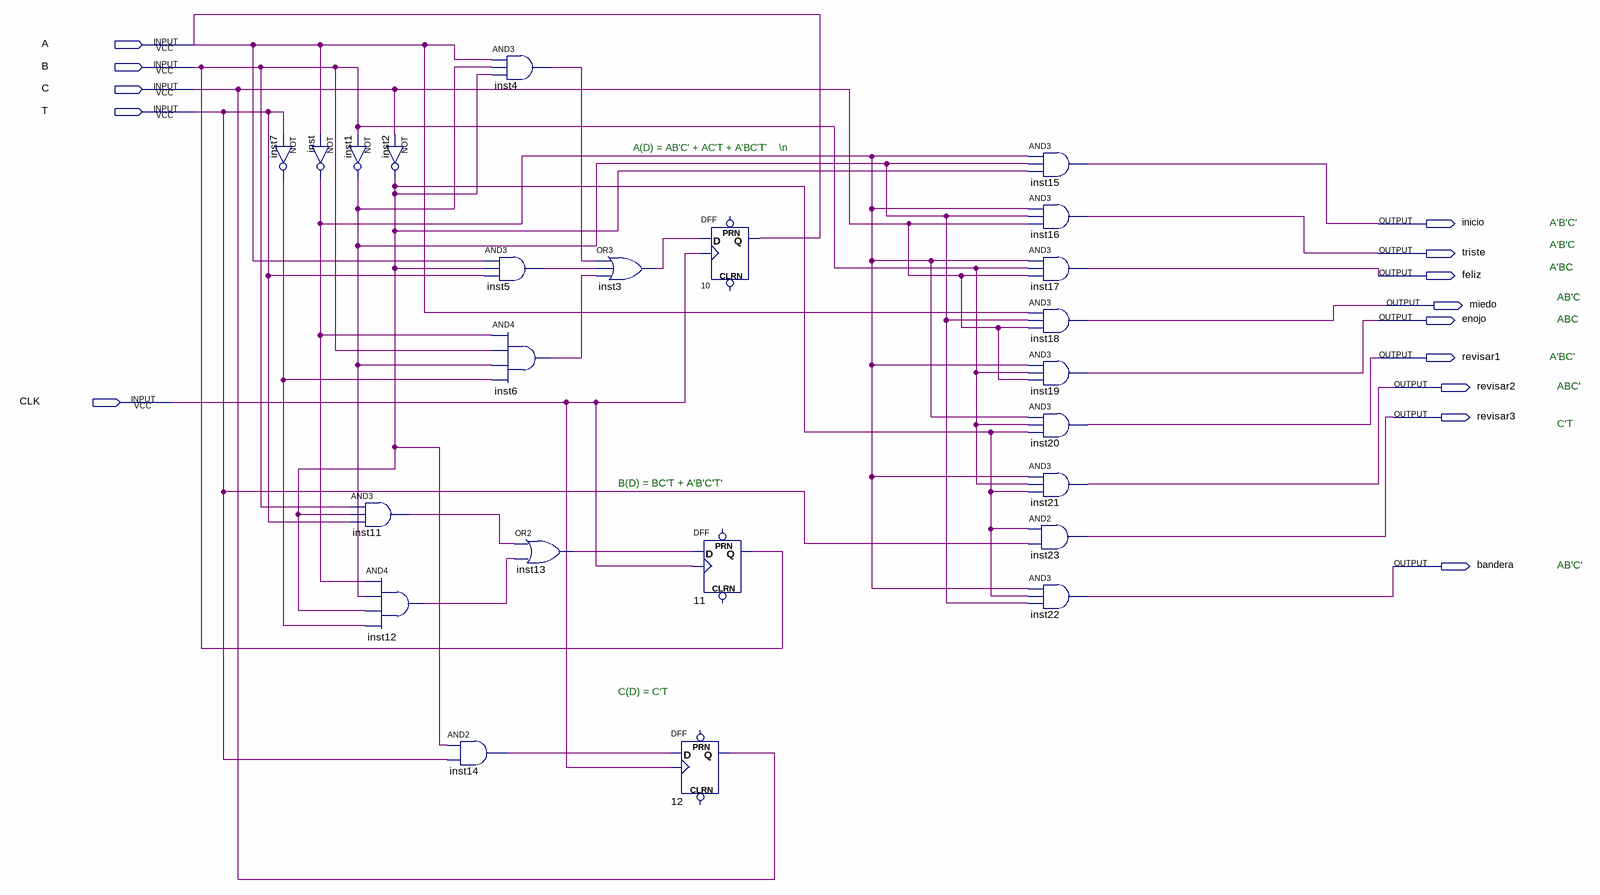
[diagram p0: schematic sheet]
// Quartus schematic Proyecto.bdf as structural Verilog: 24 symbols, 14 pins
module Proyecto (
  input  A,
  input  B,
  input  C,
  input  T,
  input  CLK,
  output inicio,
  output triste,
  output feliz,
  output miedo,
  output enojo,
  output revisar1,
  output revisar2,
  output revisar3,
  output bandera
);

  wire inst1_out, inst2_out, inst3_out, inst4_out, inst5_out, inst6_out, inst7_out, inst11_out, inst12_out,
       inst13_out, inst14_out, inst_out;

  not inst (inst_out, A);
  not inst7 (inst7_out, T);
  not inst1 (inst1_out, B);
  and inst11 (inst11_out, B, inst2_out, T);
  and inst12 (inst12_out, inst_out, inst1_out, inst2_out, inst7_out);
  not inst2 (inst2_out, C);
  and inst5 (inst5_out, A, inst2_out, T);
  and inst14 (inst14_out, inst2_out, T);
  and inst4 (inst4_out, A, inst1_out, inst2_out);
  and inst6 (inst6_out, inst_out, B, inst1_out, inst7_out);
  or inst13 (inst13_out, inst11_out, inst12_out);
  or inst3 (inst3_out, inst4_out, inst5_out, inst6_out);
  DFF u_10 (.CLK(CLK), .D(inst3_out), .Q(A));  // open: CLRN, PRN
  DFF u_11 (.CLK(CLK), .D(inst13_out), .Q(B));  // open: CLRN, PRN
  DFF u_12 (.CLK(CLK), .D(inst14_out), .Q(C));  // open: CLRN, PRN
  and inst15 (inicio, inst_out, inst1_out, inst2_out);
  and inst16 (triste, inst_out, inst1_out, C);
  and inst17 (feliz, inst_out, B, C);
  and inst18 (miedo, A, inst1_out, C);
  and inst19 (enojo, inst_out, B, C);
  and inst20 (revisar1, inst_out, B, inst2_out);
  and inst21 (revisar2, inst_out, B, inst2_out);
  and inst23 (revisar3, inst2_out, T);
  and inst22 (bandera, inst_out, inst2_out, inst1_out);

  // Notes on the sheet:
  //   A(D) = AB'C' + AC'T + A'BC'T'    \n
  //   A'B'C'
  //   A'B'C
  //   A'BC
  //   AB'C
  //   ABC
  //   A'BC'
  //   ABC'
  //   C'T
  //   B(D) = BC'T + A'B'C'T'    
  //   AB'C'
  //   C(D) = C'T    
endmodule
